# Altium project PCB_Project_MRIamp.PrjPCB (part 1 of 2)
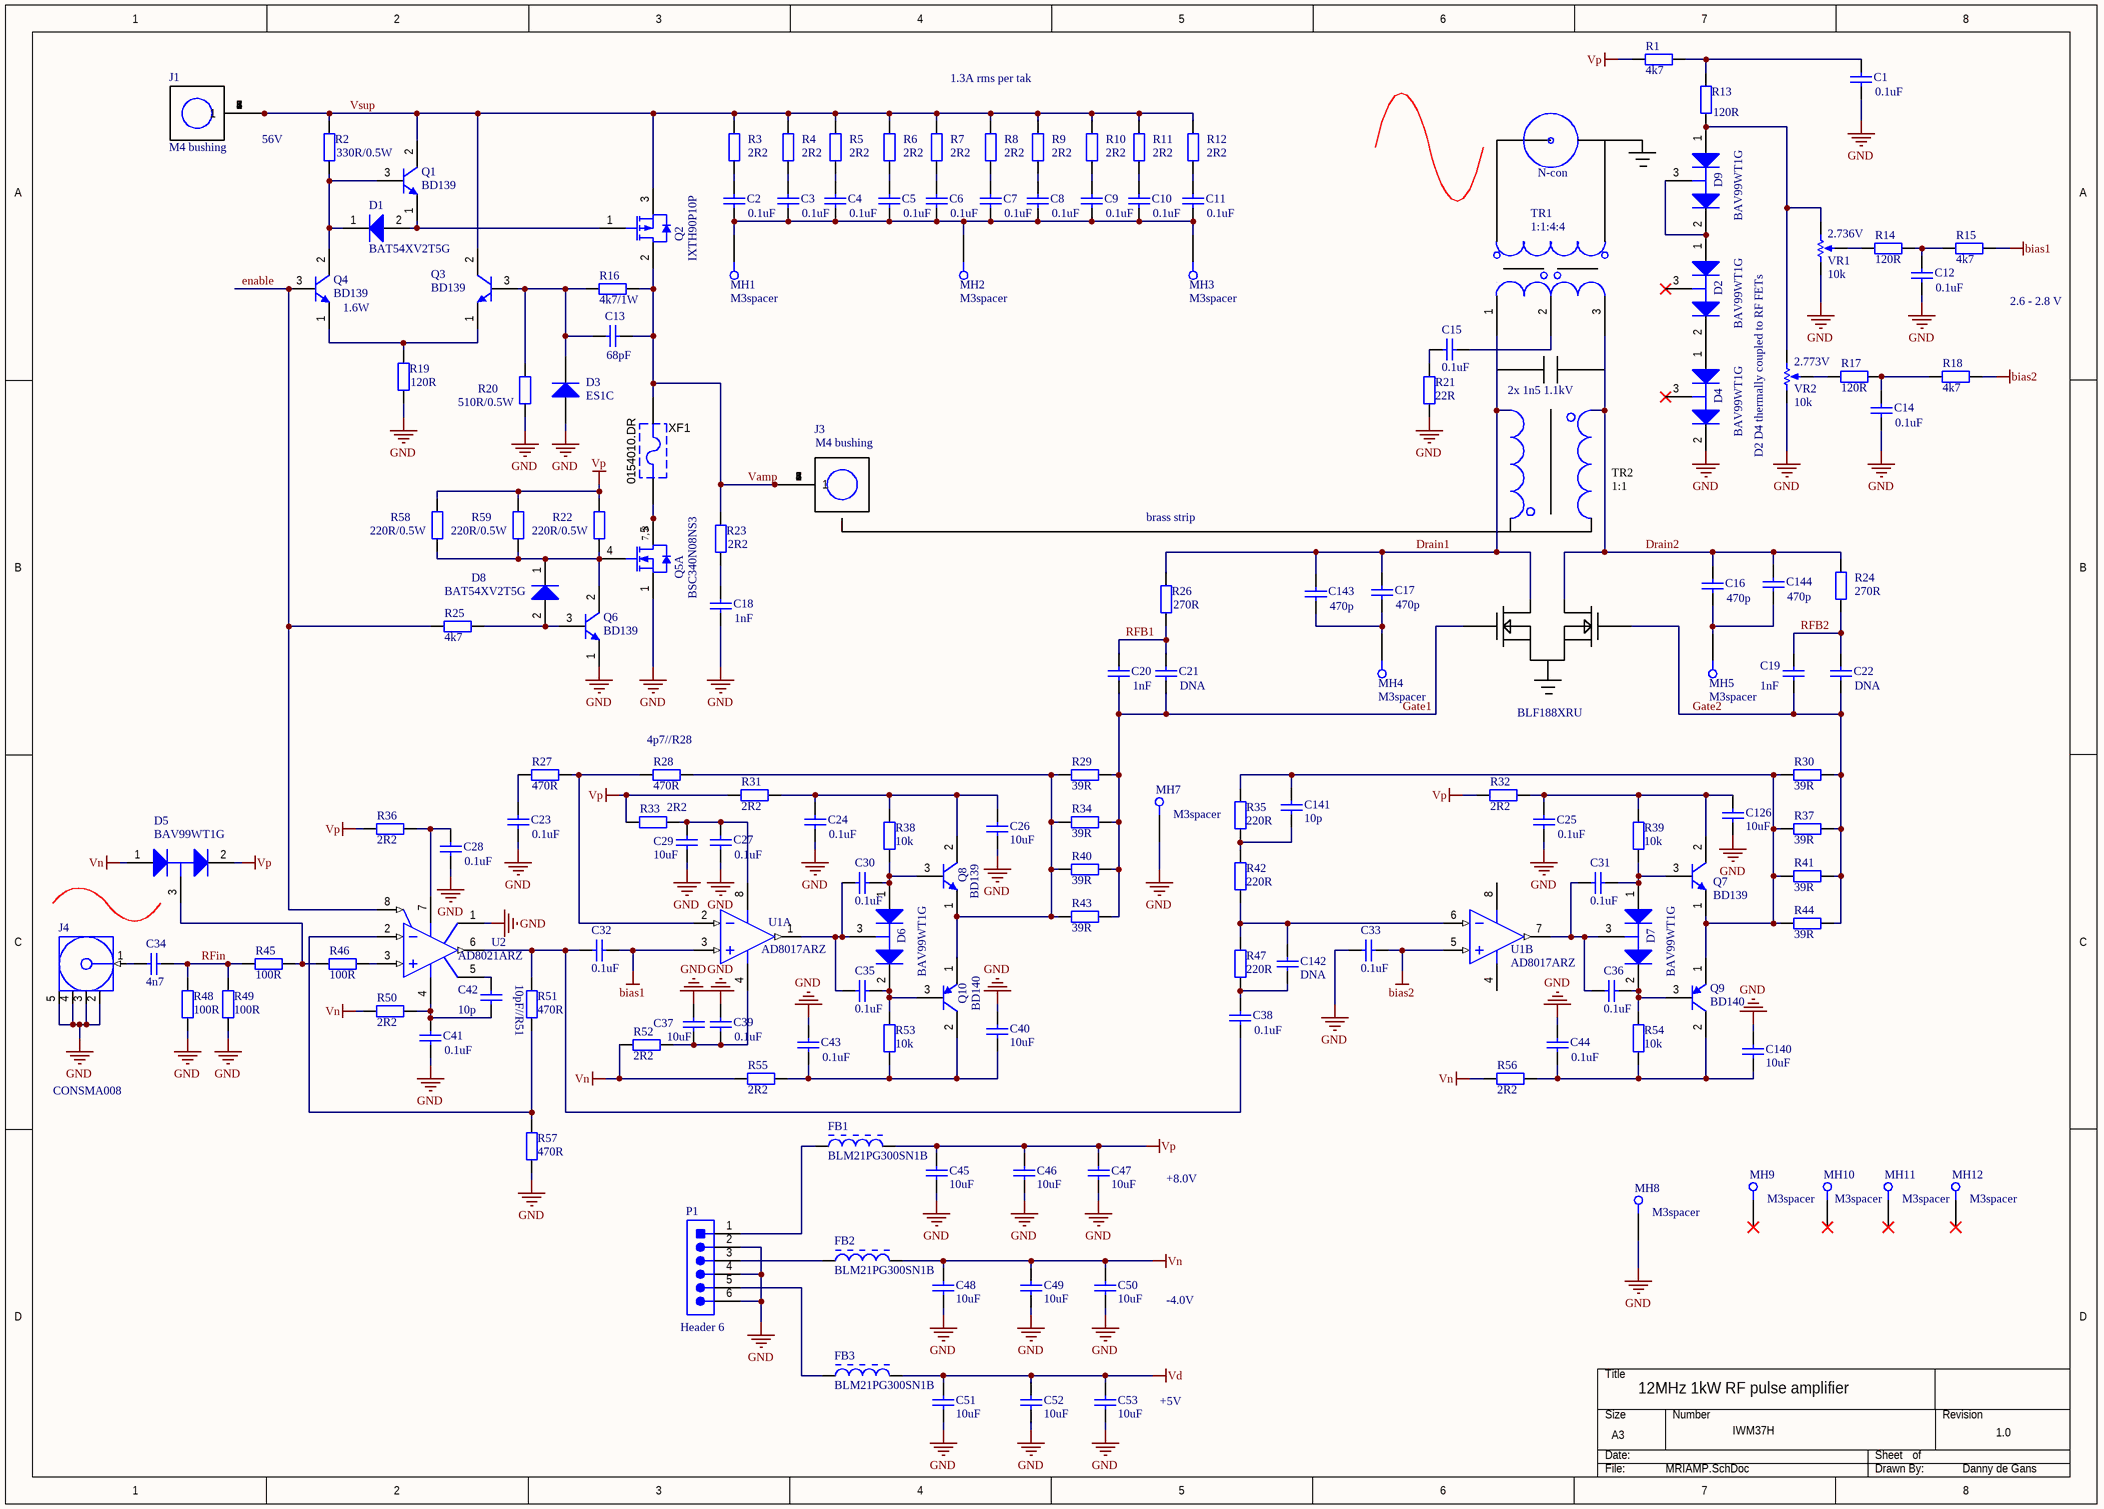
[diagram p0: MRIAMP.SchDoc]
2 sheets, 234 parts. Net scope: global (net labels, ports and power ports of the same name join across sheets).
Board file: MRIAMP.PcbDoc
Sheets:
  MRIAMP.SchDoc
  monitoring.SchDoc

## Sheet MRIAMP.SchDoc: 12MHz 1kW RF pulse amplifier
size A3; Engineer: Danny de Gans; DocumentNumber: IWM37H; Revision: 1.0; PageSetup: Record=PageOptions|CenterHorizontal=True|CenterVertical=True|PrintScale=1.04|XCorrection=1.00|YCorrection=1.00|PrintKind=0|BorderSize=5000000|LeftOffset=0|BottomOffset=0|Orientation=2|PaperLength=1000|PaperWidth=1000|Scale=100|PaperSource=7|PrintQuality=-3|MediaType=1|DitherType=10|PrintScaleMode=1|PaperKind=A3|PaperIndex=8

### Parts
C1  value 0.1uF  [SM/C_0805]  (hidden comment: Cap)
C2  value 0.1uF  [SM/C_0805]  (hidden comment: Cap)
C3  value 0.1uF  [SM/C_0805]  (hidden comment: Cap)
C4  value 0.1uF  [SM/C_0805]  (hidden comment: Cap)
C5  value 0.1uF  [SM/C_0805]  (hidden comment: Cap)
C6  value 0.1uF  [SM/C_0805]  (hidden comment: Cap)
C7  value 0.1uF  [SM/C_0805]  (hidden comment: Cap)
C8  value 0.1uF  [SM/C_0805]  (hidden comment: Cap)
C9  value 0.1uF  [SM/C_0805]  (hidden comment: Cap)
C10  value 0.1uF  [SM/C_0805]  (hidden comment: Cap)
C11  value 0.1uF  [SM/C_0805]  (hidden comment: Cap)
C12  value 0.1uF  [SM/C_0805]  (hidden comment: Cap)
C13  value 68pF  [SM/C_0805]  (hidden comment: Cap)
C14  value 0.1uF  [SM/C_0805]  (hidden comment: Cap)
C15  value 0.1uF  [SM/C_0805]  (hidden comment: Cap)
C16  value 470p  [SMD/C_1111]  (hidden comment: Cap)
C17  value 470p  [SMD/C_1111]  (hidden comment: Cap)
C18  value 1nF  [SM/C_0805]  (hidden comment: Cap)
C19  value 1nF  [SM/C_0805]  (hidden comment: Cap)
C20  value 1nF  [SM/C_0805]  (hidden comment: Cap)
C21  value DNA  [SM/C_0805]  (hidden comment: Cap)
C22  value DNA  [SM/C_0805]  (hidden comment: Cap)
C23  value 0.1uF  [SM/C_0805]  (hidden comment: Cap)
C24  value 0.1uF  [SM/C_0805]  (hidden comment: Cap)
C25  value 0.1uF  [SM/C_0805]  (hidden comment: Cap)
C26  value 10uF  [SM/C_1210]  (hidden comment: Cap)
C27  value 0.1uF  [SM/C_0805]  (hidden comment: Cap)
C28  value 0.1uF  [SM/C_0805]  (hidden comment: Cap)
C29  value 10uF  [SM/C_1210]  (hidden comment: Cap)
C30  value 0.1uF  [SM/C_0805]  (hidden comment: Cap)
C31  value 0.1uF  [SM/C_0805]  (hidden comment: Cap)
C32  value 0.1uF  [SM/C_0805]  (hidden comment: Cap)
C33  value 0.1uF  [SM/C_0805]  (hidden comment: Cap)
C34  value 4n7  [SM/C_0805]  (hidden comment: Cap)
C35  value 0.1uF  [SM/C_0805]  (hidden comment: Cap)
C36  value 0.1uF  [SM/C_0805]  (hidden comment: Cap)
C37  value 10uF  [SM/C_1210]  (hidden comment: Cap)
C38  value 0.1uF  [SM/C_0805]  (hidden comment: Cap)
C39  value 0.1uF  [SM/C_0805]  (hidden comment: Cap)
C40  value 10uF  [SM/C_1210]  (hidden comment: Cap)
C41  value 0.1uF  [SM/C_0805]  (hidden comment: Cap)
C42  value 10p  [SM/C_0805]  (hidden comment: Cap)
C43  value 0.1uF  [SM/C_0805]  (hidden comment: Cap)
C44  value 0.1uF  [SM/C_0805]  (hidden comment: Cap)
C45  value 10uF  [SM/C_1210]  (hidden comment: Cap)
C46  value 10uF  [SM/C_1210]  (hidden comment: Cap)
C47  value 10uF  [SM/C_1210]  (hidden comment: Cap)
C48  value 10uF  [SM/C_1210]  (hidden comment: Cap)
C49  value 10uF  [SM/C_1210]  (hidden comment: Cap)
C50  value 10uF  [SM/C_1210]  (hidden comment: Cap)
C51  value 10uF  [SM/C_1210]  (hidden comment: Cap)
C52  value 10uF  [SM/C_1210]  (hidden comment: Cap)
C53  value 10uF  [SM/C_1210]  (hidden comment: Cap)
C126  value 10uF  [SM/C_1210]  (hidden comment: Cap)
C140  value 10uF  [SM/C_1210]  (hidden comment: Cap)
C141  value 10p  [SM/C_0805]  (hidden comment: Cap)
C142  value DNA  [SM/C_0805]  (hidden comment: Cap)
C143  value 470p  [SMD/C_1111]  (hidden comment: Cap)
C144  value 470p  [SMD/C_1111]  (hidden comment: Cap)
D1  BAT54XV2T5G  [ONSC-SOD-523-2-502-01_V]
D2  BAV99WT1G  [ONSC-SOT-323-3-419-04_V]
D3  ES1C  [SM/DO214AC_12]
D4  BAV99WT1G  [ONSC-SOT-323-3-419-04_V]
D5  BAV99WT1G  [ONSC-SOT-323-3-419-04_V]
D6  BAV99WT1G  [ONSC-SOT-323-3-419-04_V]
D7  BAV99WT1G  [ONSC-SOT-323-3-419-04_V]
D8  BAT54XV2T5G  [ONSC-SOD-523-2-502-01_V]
D9  BAV99WT1G  [ONSC-SOT-323-3-419-04_V]
FB1  BLM21PG300SN1B  [MURA-BLM21-B40-CHIP-2_V1]
FB2  BLM21PG300SN1B  [MURA-BLM21-B40-CHIP-2_V1]
FB3  BLM21PG300SN1B  [MURA-BLM21-B40-CHIP-2_V1]
J1  M4 bushing  [BUSHING_M4]
J3  M4 bushing  [BUSHING_M4]
J4  CONSMA008  [SMA-Grotere-Gaten]
MH1  M3spacer  [MTHOLE3.2MM_TOPBOT7MM]  (no BOM)
MH2  M3spacer  [MTHOLE3.2MM_TOPBOT7MM]  (no BOM)
MH3  M3spacer  [MTHOLE3.2MM_TOPBOT7MM]  (no BOM)
MH4  M3spacer  [MTHOLE3.2MM_TOPBOT7MM]  (no BOM)
MH5  M3spacer  [MTHOLE3.2MM_TOPBOT7MM]  (no BOM)
MH7  M3spacer  [MTHOLE3.2MM_TOPBOT7MM]  (no BOM)
MH8  M3spacer  [MTHOLE3.2MM_TOPBOT7MM]  (no BOM)
MH9  M3spacer  [MTHOLE3.2MM_TOPBOT7MM]  (no BOM)
MH10  M3spacer  [MTHOLE3.2MM_TOPBOT7MM]  (no BOM)
MH11  M3spacer  [MTHOLE3.2MM_TOPBOT7MM]  (no BOM)
MH12  M3spacer  [MTHOLE3.2MM_TOPBOT7MM]  (no BOM)
P1  Header 6  [POLCON.100/VH/TM1SQS/W.300/6]
Q1  BD139  [ONSC-TO-225-3-77-09]
Q2  IXTH90P10P  [INF-PG-TO247-3-44]
Q3  BD139  [ONSC-TO-225-3-77-09]
Q4  BD139  [ONSC-TO-225-3-77-09]
Q5  BSC340N08NS3  [SO8_N]  (part A of 2)
Q6  BD139  [ONSC-TO-225-3-77-09]
Q7  BD139  [ONSC-TO-225-3-77-09]
Q8  BD139  [ONSC-TO-225-3-77-09]
Q9  BD140  [ONSC-TO-225-3-77-09]
Q10  BD140  [ONSC-TO-225-3-77-09]
R1  value 4k7  [SM/R_0805]  (hidden comment: Res2)
R2  value 330R/0.5W  [SM/R_1210]  (hidden comment: Res2)
R3  value 2R2  [SMD/R_2512]  (hidden comment: Res2)
R4  value 2R2  [SMD/R_2512]  (hidden comment: Res2)
R5  value 2R2  [SMD/R_2512]  (hidden comment: Res2)
R6  value 2R2  [SMD/R_2512]  (hidden comment: Res2)
R7  value 2R2  [SMD/R_2512]  (hidden comment: Res2)
R8  value 2R2  [SMD/R_2512]  (hidden comment: Res2)
R9  value 2R2  [SMD/R_2512]  (hidden comment: Res2)
R10  value 2R2  [SMD/R_2512]  (hidden comment: Res2)
R11  value 2R2  [SMD/R_2512]  (hidden comment: Res2)
R12  value 2R2  [SMD/R_2512]  (hidden comment: Res2)
R13  value 120R  [SM/R_0805]  (hidden comment: Res2)
R14  value 120R  [SM/R_0805]  (hidden comment: Res2)
R15  value 4k7  [SM/R_0805]  (hidden comment: Res2)
R16  value 4k7/1W  [SMD/R_2512]  (hidden comment: Res2)
R17  value 120R  [SM/R_0805]  (hidden comment: Res2)
R18  value 4k7  [SM/R_0805]  (hidden comment: Res2)
R19  value 120R  [SM/R_1206]  (hidden comment: Res2)
R20  value 510R/0.5W  [SM/R_1210]  (hidden comment: Res2)
R21  value 22R  [SMD/R_2512]  (hidden comment: Res2)
R22  value 220R/0.5W  [SM/R_1210]  (hidden comment: Res2)
R23  value 2R2  [SM/R_0805]  (hidden comment: Res2)
R24  value 270R  [AX/1.000X.225/.034]  (hidden comment: Res2)
R25  value 4k7  [SM/R_0805]  (hidden comment: Res2)
R26  value 270R  [AX/1.000X.225/.034]  (hidden comment: Res2)
R27  value 470R  [SM/R_0805]  (hidden comment: Res2)
R28  value 470R  [SM/R_0805]  (hidden comment: Res2)
R29  value 39R  [SM/R_0805]  (hidden comment: Res2)
R30  value 39R  [SM/R_0805]  (hidden comment: Res2)
R31  value 2R2  [SM/R_0805]  (hidden comment: Res2)
R32  value 2R2  [SM/R_0805]  (hidden comment: Res2)
R33  value 2R2  [SM/R_0805]  (hidden comment: Res2)
R34  value 39R  [SM/R_0805]  (hidden comment: Res2)
R35  value 220R  [SM/C_1206]  (hidden comment: Res2)
R36  value 2R2  [SM/R_0805]  (hidden comment: Res2)
R37  value 39R  [SM/R_0805]  (hidden comment: Res2)
R38  value 10k  [SM/R_0805]  (hidden comment: Res2)
R39  value 10k  [SM/R_0805]  (hidden comment: Res2)
R40  value 39R  [SM/R_0805]  (hidden comment: Res2)
R41  value 39R  [SM/R_0805]  (hidden comment: Res2)
R42  value 220R  [SM/C_1206]  (hidden comment: Res2)
R43  value 39R  [SM/R_0805]  (hidden comment: Res2)
R44  value 39R  [SM/R_0805]  (hidden comment: Res2)
R45  value 100R  [SM/C_1206]  (hidden comment: Res2)
R46  value 100R  [SM/C_1206]  (hidden comment: Res2)
R47  value 220R  [SM/C_1206]  (hidden comment: Res2)
R48  value 100R  [SM/C_1206]  (hidden comment: Res2)
R49  value 100R  [SM/C_1206]  (hidden comment: Res2)
R50  value 2R2  [SM/R_0805]  (hidden comment: Res2)
R51  value 470R  [SM/R_0805]  (hidden comment: Res2)
R52  value 2R2  [SM/R_0805]  (hidden comment: Res2)
R53  value 10k  [SM/R_0805]  (hidden comment: Res2)
R54  value 10k  [SM/R_0805]  (hidden comment: Res2)
R55  value 2R2  [SM/R_0805]  (hidden comment: Res2)
R56  value 2R2  [SM/R_0805]  (hidden comment: Res2)
R57  value 470R  [SM/R_0805]  (hidden comment: Res2)
R58  value 220R/0.5W  [SM/R_1210]  (hidden comment: Res2)
R59  value 220R/0.5W  [SM/R_1210]  (hidden comment: Res2)
TR1  1:1:4:4  [PCBComponent_1]
U1  AD8017ARZ  [ADI-R-8_L]  (parts A,B of 2)
U2  AD8021ARZ  [ADI-R-8_M]
VR1  10k  [VRES38]
VR2  10k  [VRES38]
XF1  0154010.DR  [LFUS-154_V]

### Nets
bias1: C32.1 R15.1 U1.3(+IN_1)
bias2: C33.1 R18.1 U1.5(+IN_2)
GND: C1.1 C12.1 C14.1 C18.1 C23.1 C24.1 C25.1 C26.2 C27.1 C28.1 C29.2 C33.2 C37.2 C39.2 C40.1 C41.1 C43.2 C44.2 C45.2 C46.2 C47.2 C48.2 C49.2 C50.2 C51.2 C52.2 C53.2 C126.2 C140.1 D3.1(+) D4.2(K) J4.2(GND) J4.3(GND) J4.4(GND) J4.5(GND) MH7.1(MH) MH8.1(MH) P1.2 P1.4 P1.6 Q5.1(S1) Q5.2(S2) Q5.3(S3) Q6.1(E) R19.1 R20.1 R21.2 R48.1 R49.1 R57.1 U2.1(LOGIC_REFERENCE) VR1.3(CW) VR2.3(CW)
Vd: C51.1 C52.1 C53.1 FB3.2
Vn: C48.1 C49.1 C50.1 D5.1(A) FB2.2 R50.2 R52.2 R55.2 R56.1
Vp: C45.1 C46.1 C47.1 D5.2(K) FB1.2 R1.2 R22.2 R31.2 R32.1 R33.2 R36.2 R58.2 R59.2
Drain1: C17.2 C143.2 R26.2 TR1.1
Drain2: C16.2 C144.2 R24.2 TR1.3
enable: Q4.3(B) R25.2 U2.8(~{DISABLE})
Gate1: C20.1 C21.1 R29.2 R34.2 R40.2 R43.2
Gate2: C19.1 C22.1 R30.2 R37.2 R41.2 R44.2
RFB1: C20.2 C21.2 R26.1
RFB2: C19.2 C22.2 R24.1
RFin: C34.1 R45.2 R48.2 R49.2
Vamp: C13.2 J3.1 J3.2 J3.3 J3.4 J3.5 J3.6 J3.7 J3.8 Q2.2(D) R16.1 R23.2 XF1.2
Vsup: J1.1 J1.2 J1.3 J1.4 J1.5 J1.6 J1.7 J1.8 Q1.2(C) Q2.3(S) Q3.2(C) R2.2 R3.2 R4.2 R5.2 R6.2 R7.2 R8.2 R9.2 R10.2 R11.2 R12.2
NetC1_2: C1.2 R1.1 R13.2
NetC2_1: C2.1 C3.1 C4.1 C5.1 C6.1 C7.1 C8.1 C9.1 C10.1 C11.1 MH1.1(MH) MH2.1(MH) MH3.1(MH)
NetC2_2: C2.2 R3.1
NetC3_2: C3.2 R4.1
NetC4_2: C4.2 R5.1
NetC5_2: C5.2 R6.1
NetC6_2: C6.2 R7.1
NetC7_2: C7.2 R8.1
NetC8_2: C8.2 R9.1
NetC9_2: C9.2 R10.1
NetC10_2: C10.2 R11.1
NetC11_2: C11.2 R12.1
NetC12_2: C12.2 R14.1 R15.2
NetC13_1: C13.1 D3.2(-) Q3.3(B) R16.2 R20.2
NetC14_2: C14.2 R17.1 R18.2
NetC15_1: C15.1 TR1.2
NetC15_2: C15.2 R21.1
NetC16_1: C16.1 C144.1 MH5.1(MH)
NetC17_1: C17.1 C143.1 MH4.1(MH)
NetC18_2: C18.2 R23.1
NetC23_2: C23.2 R27.1
NetC24_2: C24.2 C26.1 Q8.2(C) R31.1 R38.1
NetC25_2: C25.2 C126.1 Q7.2(C) R32.2 R39.1
NetC27_2: C27.2 C29.1 R33.1 U1.8(+VS)
NetC28_2: C28.2 R36.1 U2.7(+VS)
NetC30_1: C30.1 D6.1(A) Q8.3(B) R38.2
NetC30_2: C30.2 C35.2 D6.3(K/A) U1.1(OUT_1)
NetC31_1: C31.1 D7.1(A) Q7.3(B) R39.2
NetC31_2: C31.2 C36.2 D7.3(K/A) U1.7(OUT_2)
NetC32_2: C32.2 C38.1 R51.2 U2.6(VOUT)
NetC34_2: C34.2 J4.1(Signal)
NetC35_1: C35.1 D6.2(K) Q10.3(B) R53.1
NetC36_1: C36.1 D7.2(K) Q9.3(B) R54.1
NetC37_1: C37.1 C39.1 R52.1 U1.4(-VS)
NetC38_2: C38.2 C142.2 R47.2
NetC40_2: C40.2 C43.1 Q10.2(C) R53.2 R55.1
NetC41_2: C41.2 C42.2 R50.1 U2.4(-VS)
NetC42_1: C42.1 U2.5(CCOMP)
NetC44_1: C44.1 C140.2 Q9.2(C) R54.2 R56.2
NetC141_1: C141.1 Q7.1(E) Q9.1(E) R30.1 R35.1 R37.1 R41.1 R44.1
NetC141_2: C141.2 R35.2 R42.1
NetC142_1: C142.1 R42.2 R47.1 U1.6(-IN_2)
NetD1_1: D1.1(K) Q1.3(B) Q4.2(C) R2.1
NetD1_2: D1.2(A) Q1.1(E) Q2.1(G)
NetD2_1: D2.1(A) D9.2(K) D9.3(K/A)
NetD2_2: D2.2(K) D4.1(A)
NetD5_3: D5.3(K/A) R45.1 R46.2
NetD8_1: D8.1(K) Q5.4(G) Q6.2(C) R22.1 R58.1 R59.1
NetD8_2: D8.2(A) Q6.3(B) R25.1
NetD9_1: D9.1(A) R13.1 VR1.1(CCW) VR2.1(CCW)
NetFB1_1: FB1.1 P1.1
NetFB2_1: FB2.1 P1.3
NetFB3_1: FB3.1 P1.5
NetQ3_1: Q3.1(E) Q4.1(E) R19.2
NetQ5_5: Q5.5(D1) Q5.6(D2) Q5.7(D3) Q5.8(D4) XF1.1
NetQ8_1: Q8.1(E) Q10.1(E) R28.2 R29.1 R34.1 R40.1 R43.1
NetR14_2: R14.2 VR1.2(WIPER)
NetR17_2: R17.2 VR2.2(WIPER)
NetR27_2: R27.2 R28.1 U1.2(-IN_1)
NetR46_1: R46.1 U2.3(+IN)
NetR51_1: R51.1 R57.2 U2.2(-IN)

Not connected (* = marked no-connect by the designer): D2 3(K/A)*; D4 3(K/A)*; MH9 1(MH)*; MH10 1(MH)*; MH11 1(MH)*; MH12 1(MH)*

### Notes on the sheet
- 1.3A rms per tak
- 56V
- N-con
- (near VR1) 2.736V
- (near Q4) 1.6W
- 2.6 - 2.8 V
- (near VR2) 2.773V
- 2x 1n5 1.1kV
- (near VR2) D2 D4 thermally coupled to RF FETs
- TR2 1:1
- brass strip
- BLF188XRU
- (near R28) 4p7//R28
- (near R51) 10pF//R51
- +8.0V
- -4.0V
- +5V
- (in symbol ZXMC3A16DN8, part A) 7, 8

### Library data of the parts
C1-C12 C14 C15 C23-C25 C27 C28 C30-C33 C35 C36 C38 C39 C41 C43 C44 = Cap: Capacitor; FA: 2470440; Published: 8-Jun-2000; LatestRevisionDate: 17-Jul-2002; LatestRevisionNote: Re-released for DXP Platform.; PackageReference: RAD-0.3; Publisher: Altium Limited; PackageDescription: Radial Cap, Thru-Hole; 2 Leads; 0.3 in Pin Spacing
C13 = Cap: Capacitor; FA: 1759274; Published: 8-Jun-2000; LatestRevisionDate: 17-Jul-2002; LatestRevisionNote: Re-released for DXP Platform.; PackageReference: RAD-0.3; Publisher: Altium Limited; PackageDescription: Radial Cap, Thru-Hole; 2 Leads; 0.3 in Pin Spacing
C16 C17 C143 C144 = Cap: Capacitor; FA: 2420162; Published: 8-Jun-2000; LatestRevisionDate: 17-Jul-2002; LatestRevisionNote: Re-released for DXP Platform.; PackageReference: RAD-0.3; Publisher: Altium Limited; PackageDescription: Radial Cap, Thru-Hole; 2 Leads; 0.3 in Pin Spacing
C18-C22 = Cap: Capacitor; FA: 1740687; Published: 8-Jun-2000; LatestRevisionDate: 17-Jul-2002; LatestRevisionNote: Re-released for DXP Platform.; PackageReference: RAD-0.3; Publisher: Altium Limited; PackageDescription: Radial Cap, Thru-Hole; 2 Leads; 0.3 in Pin Spacing
C26 C29 C37 C40 C45-C53 C126 C140 = Cap: Capacitor; FA: 1828840; Published: 8-Jun-2000; LatestRevisionDate: 17-Jul-2002; LatestRevisionNote: Re-released for DXP Platform.; PackageReference: RAD-0.3; Publisher: Altium Limited; PackageDescription: Radial Cap, Thru-Hole; 2 Leads; 0.3 in Pin Spacing
C34 = Cap: Capacitor; FA: 8820058; Published: 8-Jun-2000; LatestRevisionDate: 17-Jul-2002; LatestRevisionNote: Re-released for DXP Platform.; PackageReference: RAD-0.3; Publisher: Altium Limited; PackageDescription: Radial Cap, Thru-Hole; 2 Leads; 0.3 in Pin Spacing
C42 C141 = Cap: Capacitor; FA: 2497005; Published: 8-Jun-2000; LatestRevisionDate: 17-Jul-2002; LatestRevisionNote: Re-released for DXP Platform.; PackageReference: RAD-0.3; Publisher: Altium Limited; PackageDescription: Radial Cap, Thru-Hole; 2 Leads; 0.3 in Pin Spacing
C142 = Cap: Capacitor; Published: 8-Jun-2000; LatestRevisionDate: 17-Jul-2002; LatestRevisionNote: Re-released for DXP Platform.; PackageReference: RAD-0.3; Publisher: Altium Limited; PackageDescription: Radial Cap, Thru-Hole; 2 Leads; 0.3 in Pin Spacing
D1 D8 = CMP-1055-00490-1: Schottky Barrier Diode, 2-Pin SOD-523, Pb-Free, Tape and Reel; Manufacturer: On Semiconductor; IFSM Max (A): 0.6; trr Max (ns): 5; Configuration: Single; FA: 2322476; PackageDescription: 2-Pin SOD, Body 1.2 x 0.8 mm; PackageReference: SOD-523-2-502-01; DatasheetVersion: Rev. 8; Packing: Tape and Reel; PackageVersion: Rev. E, 09/2010; ComponentLink2Description: Datasheet; ComponentLink3URL: http://www.onsemi.com/pub_link/Collateral/502-01.PDF; PartNumber: BAT54XV2T5G; RoHS: TRUE; ComponentLink2URL: http://www.onsemi.cn/pub_link/Collateral/BAT54XV2T1-D.PDF; ComponentLink1Description: Manufacturer URL; Mounting Technology: Surface Mount; ComponentLink3Description: Package Specification; ComponentLink1URL: http://www.onsemi.com/
D2 D4-D7 D9 = CMP-1054-00187-1: Dual Series Switching Diodes, 3-Pin SOT-323, Pb-Free, Tape and Reel; Manufacturer: On Semiconductor; trr Max (ns): 6; IF Max (A): 0.215; FA: 1081212; Configuration: Dual Series; ComponentLink1Description: Manufacturer URL; ComponentLink1URL: http://www.onsemi.com/; ComponentLink2Description: Datasheet; PackageDescription: 3-Pin Small Outline Transistor, Body 2 x 1.25 mm, Pitch 0.65 mm; PackageReference: SOT-323-3-419-04; ComponentLink3URL: http://www.onsemi.com/pub_link/Collateral/419-04.PDF; Packing: Tape and Reel; ComponentLink3Description: Package Specification; DatasheetVersion: Rev. 7; RoHS: TRUE; ComponentLink2URL: http://www.onsemi.cn/pub_link/Collateral/BAV99WT1-D.PDF; Mounting Technology: Surface Mount; PartNumber: BAV99WT1G; PackageVersion: Rev. N, 11/2008
D3 = CMP-0914-00001-1: Fast Switching Diode, 75 V, 150 mA, 2-Pin 2.7 x 1.6 x 1.25 mm SMD, Tape and Reel; PartNumber: 1N4148W; Manufacturer: Changjiang Electronics; TSTG (degC): -55 to 150; IR (uA): 1; VR (V): 75; VF (V): 1.25; PD (mW): 350; Trr (ns): 4; IO (mA): 150; FA: 2453261; Packing: Tape and Reel; ComponentLink2URL: http://www.cj-elec.com/txUpfile/20121613352740313.pdf; PackageReference: SOD-123-2; PackageVersion: Rev. A; DatasheetVersion: Rev. A; ComponentLink3Description: Package Specification; ComponentLink3URL: http://www.cj-elec.com/txUpfile/201412112231195145.pdf; ComponentLink1Description: Manufacturer URL; ComponentLink1URL: http://www.cj-elec.com/; ComponentLink2Description: Datasheet; PackageDescription: 2-Pin SMD, Body 2.7 x 1.6 mm, Height 1.25 mm; Mounting Technology: Surface Mount
FB1-FB3 = CMP-0686-00617-2: Chip Ferrite Bead for Power Lines, 30 Ohm, 4000 mA, -55 to 125 degC, 2 x 1.25 x 1.05 mm SMD, Bulk; Manufacturer: Murata; Rated Current: 4000 mA; DC Resistance: 0.014 Ohm Max.; Impedance (at 100 MHz): 30 Ohm Typ.; FA: 1515662; PackageReference: BLM21_H1050-2; ComponentLink2Description: Datasheet; ComponentLink3Description: Package Specification; Mounting Technology: Surface Mount; DatasheetVersion: 08/2013; ComponentLink3URL: http://www.murata.com/products/catalog/pdf/c31e.pdf; ComponentLink2URL: http://www.murata.com/products/catalog/pdf/c31e.pdf; PackageDescription: 2-Pin Chip, Body 2 x 1.25 mm; Packing: Bulk; PartNumber: BLM21PG300SN1B; ComponentLink1Description: Manufacturer URL; ComponentLink1URL: http://www.murata.com/; Operating Temperature Range: -55 to 125 degC
J1 J3 = Component_1: FA: 1821272
J4 = CMP-0168-00003-1: SMA Female PCB Mount Connector - Extended; FA: 2112465; PackageDescription: SMA Female PCB Mount Connector, Extended, Thru-Hole, 7 x 7 mm Body; PackageReference: CON-SMA-L; DatasheetVersion: revB, Feb-2010; PackageVersion: revB, Feb-2010
MH1-MH5 MH7-MH12 = CMP-0001-00114-1: Mounting Hole, Embedded System Module, 3.2mm pad, 2.7mm plated hole, Top / Bottom copper regions; ClassName: Mounting Hole; Publisher: Altium; Package Reference: Mounting-Hole-ESM
P1 = CMP-1681-00007-2: Male Header, Pitch 2.54 mm, 1 x 6 Position, Height 8.38 mm, Tail Length 2.54 mm, -55 to 125 degC, RoHS, Bulk; Manufacturer: Samtec; Rows: 1; FA: 588611; Contact Finish: Gold; Lead Pitch: 0.1 inch; Package Quantity: 1; Mounting Technology: Through Hole; ComponentLink1Description: Manufacturer URL; Contact Plating: Gold; DatasheetVersion: 12/2015; ComponentLink3Description: Package Specification; PackageDescription: Male Header, Pitch 2.54 mm, 1 x 6 Position, Height 8.38 mm, Tail Length 2.54 mm; Height: 8.38 mm; ComponentLink2Description: Datasheet; RoHSCompliant: true; Colour: Black; Packaging: Bulk; Min Operating Temperature: -55 degC; ComponentLink2URL: http://suddendocs.samtec.com/catalog_english/tsw_th.pdf; Mount: Through Hole; PackageReference: TSW-102-07-S-S; Pins: 6; Max Operating Temperature: 125 degC; ComponentLink3URL: http://suddendocs.samtec.com/prints/tsw-xxx-xx-x-x-xx-xxx-footprint.pdf; Length: 15.24 mm; Contact Material: Bronze; ComponentLink1URL: http://www.samtec.com/
Q1 Q3 Q4 Q6-Q8 = CMP-1048-01269-1: Plastic Medium-Power Silicon NPN Transistor, 3-Pin TO-225, Pb-Free, Bulk Box; Manufacturer: On Semiconductor; PartNumber: BD139G; IC Continuous (A): 1.5; FA: 1015770; ComponentLink2URL: http://www.onsemi.com/pub_link/Collateral/BD135-D.PDF; Polarity: NPN; DatasheetVersion: Rev. 16; RoHS: TRUE; PackageReference: TO-225-3-77-09; Packing: Bulk Box; ComponentLink1URL: http://www.onsemi.com/; PackageVersion: Rev. AC, 12/2013; ComponentLink3URL: http://www.onsemi.com/pub_link/Collateral/77-09.PDF; ComponentLink3Description: Package Specification; Mounting Technology: Through Hole; PackageDescription: 3-Pin Flange Mount, Vertical Straight Lead, Body 7.6 x 2.7 mm, Pitch 2.29 mm; ComponentLink1Description: Manufacturer URL; ComponentLink2Description: Datasheet
Q2 = CMP-1258-00121-1: P-Channel Enhancement Mode MOS Transistor, -30 V, -0.47 A, -55 to 150 degC, 3-Pin SOT23, Tape and Reel; Manufacturer: NXP Semiconductors; PartNumber: BSH203,215; VGSth [typ] (V): -0.68; Channel Type: P; Qr [typ] (nC): 28; Coss [typ] (pF): 27; Packing: Tape & Reel; Ciss [typ] (pF): 110; MO: 747-IXTH90P10P; PackageVersion: 06-03-16, 03/2006; Mounting Technology: Surface Mount; ComponentLink3URL: http://www.nxp.com/documents/outline_drawing/sot023_po.pdf; ComponentLink1Description: Manufacturer URL; PackageReference: SOT23; ID [max] (A): -0.47; DatasheetVersion: Rev. 1.000; ComponentLink2URL: http://www.nxp.com/documents/data_sheet/BSH203.pdf; VDS [max] (V): -30; ComponentLink3Description: Package Specification; ComponentLink2Description: Datasheet; ComponentLink1URL: http://www.nxp.com/; PackageDescription: 3-Pin Small Outline Transistor Package, Body 2.9 x 1.3 mm, Pitch 0.95 mm; Code_JEDEC: TO-236AB
Q5 = ZXMC3A16DN8: Complementary 30V Enhancement Mode MOSFET; FA: 2212853; Published: 17-Dec-2003; LatestRevisionDate: 13-Apr-2006; LatestRevisionNote: IPC-7351 Footprint Added.; DatasheetVersion: Oct-02; PackageVersion: Nov-1998; PackageReference: SO8; Publisher: Altium Limited; PackageDescription: 8-Pin Small Outline Integrated Circuit 1.27 mm Pitch; Code_JEDEC: MS-012-AA; Code_IPC: SOIC127P600-8; ComponentLink1Description: Manufacturer Link; ComponentLink1URL: http://www.zetex.com/; ComponentLink2Description: Datasheet; ComponentLink2URL: www.zetex.com/3.0/pdf/ZXMC3A16DN8.pdf
Q9 Q10 = CMP-1048-00039-1: Plastic Medium-Power Silicon PNP Transistor, 3-Pin TO-225, Bulk Box; Manufacturer: On Semiconductor; IC Continuous (A): 1.5; FA: 2341704; PartNumber: BD140; ComponentLink1Description: Manufacturer URL; RoHS: FALSE; ComponentLink1URL: http://www.onsemi.com/; DatasheetVersion: Rev. 15; ComponentLink2URL: http://www.onsemi.com/pub_link/Collateral/BD136-D.PDF; ComponentLink3Description: Package Specification; Packing: Bulk Box; PackageVersion: Rev. AC, 12/2013; ComponentLink3URL: http://www.onsemi.com/pub_link/Collateral/77-09.PDF; PackageDescription: 3-Pin Flange Mount, Vertical Straight Lead, Body 7.6 x 2.7 mm, Pitch 2.29 mm; Mounting Technology: Through Hole; PackageReference: TO-225-3-77-09; ComponentLink2Description: Datasheet; Polarity: PNP
R1 R15 R18 R25 = Res2: Resistor; FA: 2447672; Published: 8-Jun-2000; LatestRevisionDate: 17-Jul-2002; LatestRevisionNote: Re-released for DXP Platform.; PackageReference: AXIAL-0.4; Publisher: Altium Limited; PackageDescription: Axial Device, Thru-Hole; 2 Leads; 0.4 in Pin Spacing
R2 = Res2: Resistor; FA: 2324053; Published: 8-Jun-2000; LatestRevisionDate: 17-Jul-2002; LatestRevisionNote: Re-released for DXP Platform.; PackageReference: AXIAL-0.4; Publisher: Altium Limited; PackageDescription: Axial Device, Thru-Hole; 2 Leads; 0.4 in Pin Spacing
R3-R12 = Res2: Resistor; FA: 2476359; Published: 8-Jun-2000; LatestRevisionDate: 17-Jul-2002; LatestRevisionNote: Re-released for DXP Platform.; PackageReference: AXIAL-0.4; Publisher: Altium Limited; PackageDescription: Axial Device, Thru-Hole; 2 Leads; 0.4 in Pin Spacing
R13 R14 R17 = Res2: Resistor; FA: 2447561; Published: 8-Jun-2000; LatestRevisionDate: 17-Jul-2002; LatestRevisionNote: Re-released for DXP Platform.; PackageReference: AXIAL-0.4; Publisher: Altium Limited; PackageDescription: Axial Device, Thru-Hole; 2 Leads; 0.4 in Pin Spacing
R16 = Res2: Resistor; FA: 1265213; Published: 8-Jun-2000; LatestRevisionDate: 17-Jul-2002; LatestRevisionNote: Re-released for DXP Platform.; PackageReference: AXIAL-0.4; Publisher: Altium Limited; PackageDescription: Axial Device, Thru-Hole; 2 Leads; 0.4 in Pin Spacing
R19 = Res2: Resistor; FA: 1100167; Published: 8-Jun-2000; LatestRevisionDate: 17-Jul-2002; LatestRevisionNote: Re-released for DXP Platform.; PackageReference: AXIAL-0.4; Publisher: Altium Limited; PackageDescription: Axial Device, Thru-Hole; 2 Leads; 0.4 in Pin Spacing
R20 = Res2: Resistor; FA: 2380767; Published: 8-Jun-2000; LatestRevisionDate: 17-Jul-2002; LatestRevisionNote: Re-released for DXP Platform.; PackageReference: AXIAL-0.4; Publisher: Altium Limited; PackageDescription: Axial Device, Thru-Hole; 2 Leads; 0.4 in Pin Spacing
R21 = Res2: Resistor; FA: 1265187; Published: 8-Jun-2000; LatestRevisionDate: 17-Jul-2002; LatestRevisionNote: Re-released for DXP Platform.; PackageReference: AXIAL-0.4; Publisher: Altium Limited; PackageDescription: Axial Device, Thru-Hole; 2 Leads; 0.4 in Pin Spacing
R22 R58 R59 = Res2: Resistor; FA: 2324036; Published: 8-Jun-2000; LatestRevisionDate: 17-Jul-2002; LatestRevisionNote: Re-released for DXP Platform.; PackageReference: AXIAL-0.4; Publisher: Altium Limited; PackageDescription: Axial Device, Thru-Hole; 2 Leads; 0.4 in Pin Spacing
R23 R31-R33 R36 R50 R52 R55 R56 = Res2: Resistor; FA: 2074326; Published: 8-Jun-2000; LatestRevisionDate: 17-Jul-2002; LatestRevisionNote: Re-released for DXP Platform.; PackageReference: AXIAL-0.4; Publisher: Altium Limited; PackageDescription: Axial Device, Thru-Hole; 2 Leads; 0.4 in Pin Spacing
R24 R26 = Res2: Resistor; FA: 1738681; Published: 8-Jun-2000; LatestRevisionDate: 17-Jul-2002; LatestRevisionNote: Re-released for DXP Platform.; PackageReference: AXIAL-0.4; Publisher: Altium Limited; PackageDescription: Axial Device, Thru-Hole; 2 Leads; 0.4 in Pin Spacing
R27 R28 R51 R57 = Res2: Resistor; FA: 2074468; Published: 8-Jun-2000; LatestRevisionDate: 17-Jul-2002; LatestRevisionNote: Re-released for DXP Platform.; PackageReference: AXIAL-0.4; Publisher: Altium Limited; PackageDescription: Axial Device, Thru-Hole; 2 Leads; 0.4 in Pin Spacing
R29 R30 R34 R37 R40 R41 R43 R44 = Res2: Resistor; FA: 2074459; Published: 8-Jun-2000; LatestRevisionDate: 17-Jul-2002; LatestRevisionNote: Re-released for DXP Platform.; PackageReference: AXIAL-0.4; Publisher: Altium Limited; PackageDescription: Axial Device, Thru-Hole; 2 Leads; 0.4 in Pin Spacing
R35 R42 R47 = Res2: Resistor; FA: 2447486; Published: 8-Jun-2000; LatestRevisionDate: 17-Jul-2002; LatestRevisionNote: Re-released for DXP Platform.; PackageReference: AXIAL-0.4; Publisher: Altium Limited; PackageDescription: Axial Device, Thru-Hole; 2 Leads; 0.4 in Pin Spacing
R38 R39 R53 R54 = Res2: Resistor; FA: 2447553; Published: 8-Jun-2000; LatestRevisionDate: 17-Jul-2002; LatestRevisionNote: Re-released for DXP Platform.; PackageReference: AXIAL-0.4; Publisher: Altium Limited; PackageDescription: Axial Device, Thru-Hole; 2 Leads; 0.4 in Pin Spacing
R45 R46 R48 R49 = Res2: Resistor; FA: 2447454; Published: 8-Jun-2000; LatestRevisionDate: 17-Jul-2002; LatestRevisionNote: Re-released for DXP Platform.; PackageReference: AXIAL-0.4; Publisher: Altium Limited; PackageDescription: Axial Device, Thru-Hole; 2 Leads; 0.4 in Pin Spacing
TR1 = Component_1: MO: 623-2661102002
U1 = CMP-0384-00604-1: Double Channel Low Power Operational Amplifier, 160 MHz BW, 1.6 KV/us SR, Industrial, 8-pin SOIC (R-8), Reel; Manufacturer: Analog Devices; PartNumber: AD8017ARZ-REEL7; Generic Part Number: AD8017; Amplifiers Per Package: 2; Input Offset Voltage: 1.8mV; Small Signal Bandwidth: 160MHz; Input Bias Current: 160uA; V Span Min: 4.4V; Iq/Amp: 7.7mA; V Span Max: 12V; FA: 9425705; ComponentLink3URL: http://www.analog.com/static/imported-files/packages/PKG_PDF/SOIC_Narrow%20(R)/R_8.pdf; Slew Rate: 1.6KV/us; ComponentLink2URL: http://www.analog.com/static/imported-files/data_sheets/AD8017.pdf; PackageDescription: 8-Pin Standard Small Outline Package, Body 3.9 x 4.9 mm, Pitch 1.27 mm; ComponentLink2Description: Datasheet; ComponentLink1Description: Manufacturer URL; PackageVersion: 060506-A; ComponentLink3Description: Package Specification; PackageReference: R-8; DatasheetVersion: Rev. C; ComponentLink1URL: http://www.analog.com/en/index.html; Code_JEDEC: MS-012-AA; Mounting Technology: Surface Mount
U2 = CMP-0384-00646-1: Single Channel Low Power Operational Amplifier, 490 MHz BW, 120 V/us SR, Industrial, 8-pin SOIC (R-8), Tube; Manufacturer: Analog Devices; Generic Part Number: AD8021; V Span Min: 4.5V; Iq/Amp: 7.7mA; Input Bias Current: 7.5uA; Small Signal Bandwidth: 490MHz; V Span Max: 24V; Amplifiers Per Package: 1; Input Offset Voltage: 400uV; FA: 9426000; ComponentLink1URL: http://www.analog.com/en/index.html; ComponentLink3URL: http://www.analog.com/static/imported-files/packages/PKG_PDF/SOIC_Narrow%20(R)/R_8.pdf; ComponentLink2URL: http://www.analog.com/static/imported-files/data_sheets/AD8021.pdf; DatasheetVersion: Rev. F; PartNumber: AD8021ARZ; ComponentLink2Description: Datasheet; PackageReference: R-8; Code_JEDEC: MS-012-AA; Slew Rate: 120V/us; ComponentLink4Description: URL Link1; ComponentLink3Description: Package Specification; ComponentLink4URL: Reference Circuit:http://www.analog.com/en/all-operational-amplifiers-op-amps/operational-amplifiers-op-amps/ad8021/products/product.html#product-recommendations; PackageDescription: 8-Pin Standard Small Outline Package, Body 3.9 x 4.9 mm, Pitch 1.27 mm; PackageVersion: 060506-A; ComponentLink1Description: Manufacturer URL; Mounting Technology: Surface Mount
VR1 VR2 = CMP-0975-00007-1: Trimming Potentiometer, 10K Ohm +/- 10%, -55 to 125 degC, 3-Pin 19.05 x 4.83 x 6.6 mm THD, Transparent Housing, RoHS; PartNumber: 3006P-7-103ZLF; Manufacturer: Bourns; Resistance (kOhm): 10; Rotational Life: 200 Cycles; Number of Turns: 15; Resistance Tolerance: +/- 10%; FA: 9352651; DatasheetVersion: Apr-14; ComponentLink3URL: http://www.bourns.com/data/global/pdfs/3006.pdf; ComponentLink2Description: Datasheet; Temperature Range: -55 to 125 degC; ComponentLink1Description: Manufacturer URL; ComponentLink2URL: http://www.bourns.com/data/global/pdfs/3006.pdf; PackageDescription: 3-Pin THD, Body 19.05 x 4.83 mm, Height 6.6 mm; PackageReference: 3006P-3; ComponentLink3Description: Package Specification; RoHS: TRUE; Mounting Technology: Through Hole; ComponentLink1URL: http://www.bourns.com/; PackageVersion: Apr-14
XF1 = CMP-2000-05598-1: Fuse Holder, 125 V, 10 A, -55 to 125 degC, 2-Pin SMD, RoHS, Tape and Reel; Manufacturer: Littelfuse; Case Width: 5.03mm; Voltage Rating AC: 72V; Fuse Size / Group: OMNI-BLOK; Case Height: 3.81mm; Voltage Rating DC: 60V; Fuse Type: FastBlow; Body Material: Ceramic,Thermoplastic; Case Length: 9.73mm; Voltage Rating: 125V; Current Rating: 10A; FA: 1817192; Manufacturer URL: http://www.littelfuse.com/; Product: SurfaceMountFuses; Dimensions: 9.73mmLx5.03mmW; Packaging: Reel; Package Description: 2-Pin Surface Mount Device, Body 9.73 x 5.03 mm; Datasheet URL: http://www.littelfuse.com/~/media/electronics/datasheets/fuses/littelfuse_fuse_154_154t_154l_154tl_datasheet.pdf.pdf; Factory Pack Quantity: 1500; Package Reference: 154; Series: 154; Termination Style: SMD/SMT; Product Category: SurfaceMountFuses; Mounting Technology: SurfaceMount; Product Type: SurfaceMountFusewithFuseHolder; Datasheet Version: 04/2016; Operating Temperature Range: -55Cto+125C; Type: Omni-BlokSMD/SMTFuseandHolderAssembly; RoHS: Details; Mounting Style: SMD/SMT; Brand: Littelfuse